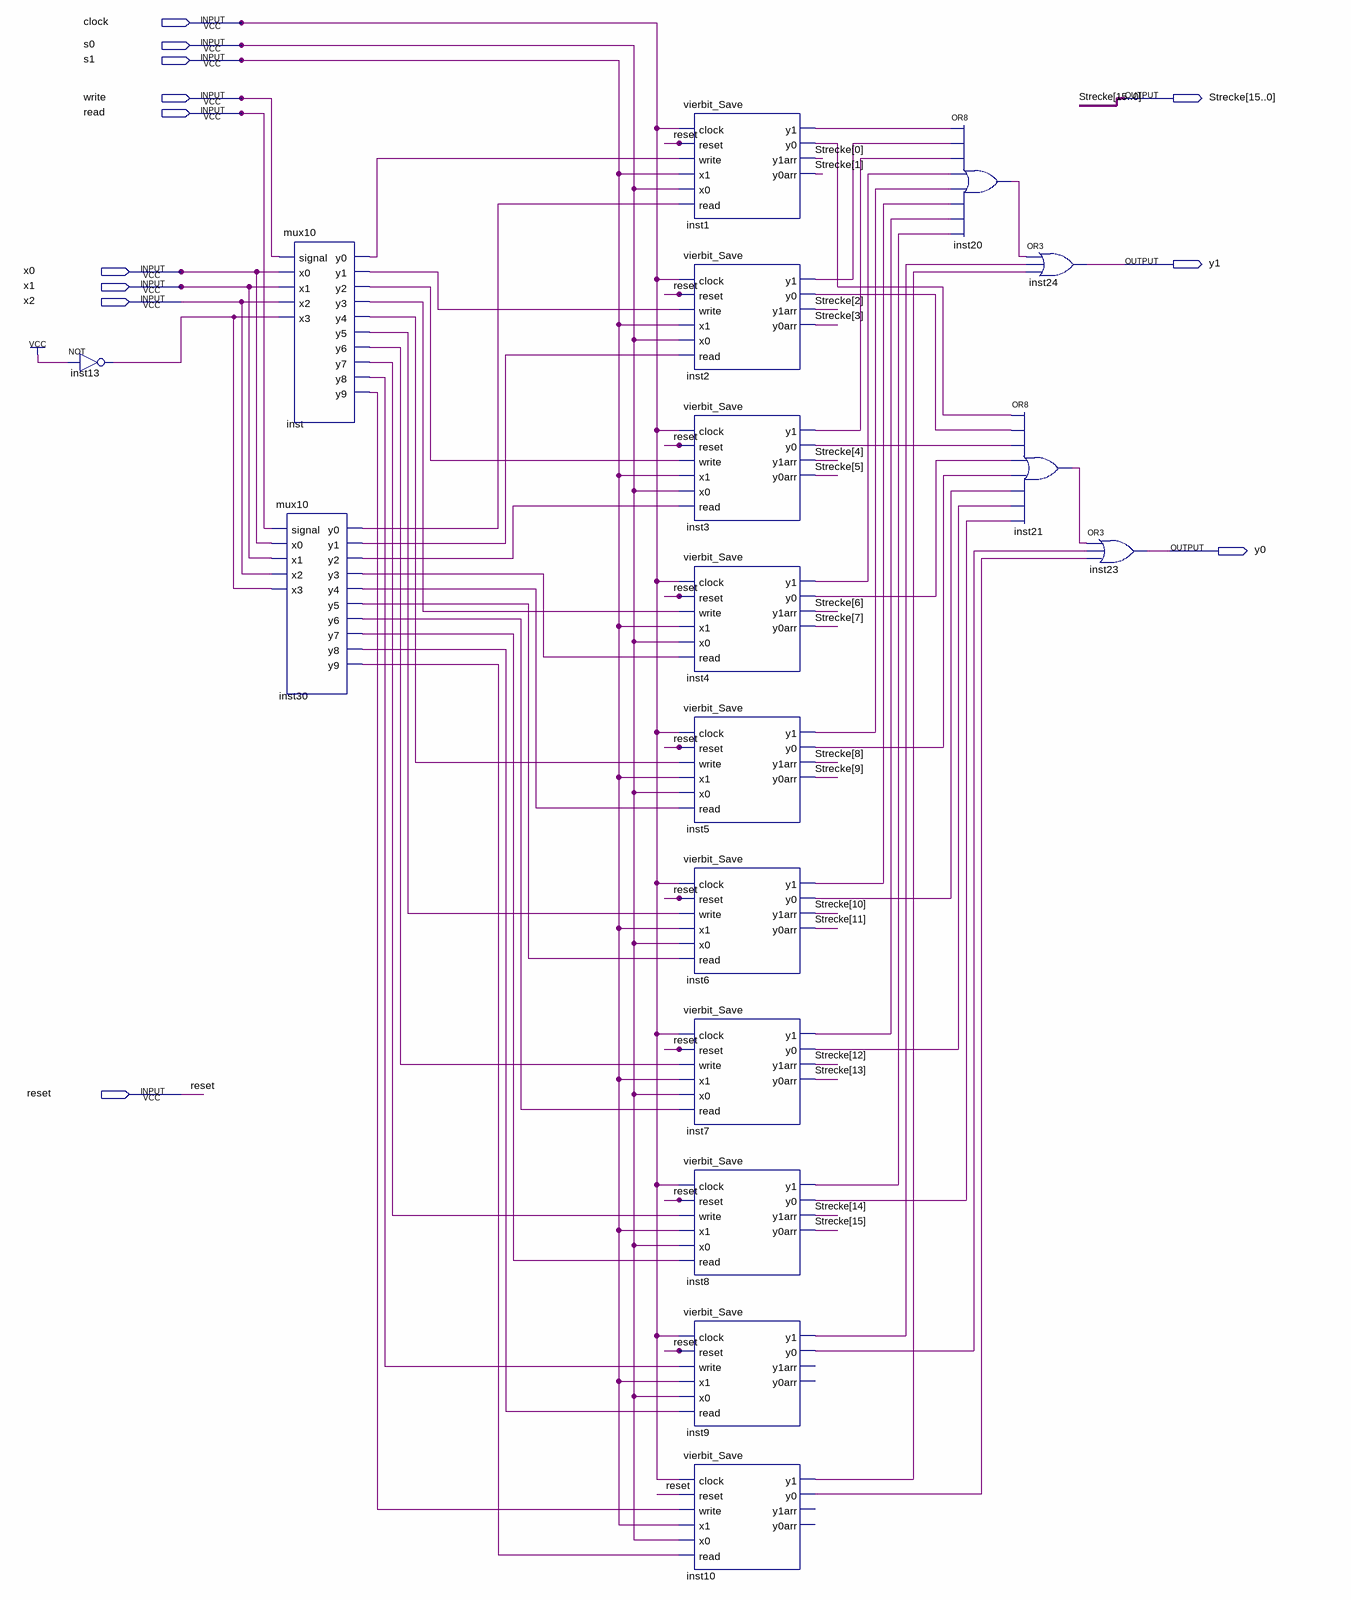
[diagram p0: schematic sheet]
// Quartus schematic routen_speicher.bdf as structural Verilog: 17 symbols, 12 pins
module routen_speicher (
  input  clock,
  input  s0,
  input  s1,
  input  write,
  input  read,
  input  x0,
  input  x1,
  input  x2,
  input  reset,
  output [15:0] Strecke,
  output y1,
  output y0
);

  wire inst1_y0, inst1_y1, inst2_y0, inst2_y1, inst3_y0, inst3_y1, inst4_y0, inst4_y1, inst5_y0, inst5_y1,
       inst6_y0, inst6_y1, inst7_y0, inst7_y1, inst8_y0, inst8_y1, inst9_y0, inst9_y1, inst10_y0, inst10_y1,
       inst13_out, inst20_out, inst21_out, inst30_y0, inst30_y1, inst30_y2, inst30_y3, inst30_y4, inst30_y5,
       inst30_y6, inst30_y7, inst30_y8, inst30_y9, inst_y0, inst_y1, inst_y2, inst_y3, inst_y4, inst_y5,
       inst_y6, inst_y7, inst_y8, inst_y9;

  not inst13 (inst13_out, 1'b1);
  mux10 inst (
    .signal(write), .x0(x0), .x1(x1), .x2(x2), .x3(inst13_out), .y0(inst_y0), .y1(inst_y1), .y2(inst_y2),
    .y3(inst_y3), .y4(inst_y4), .y5(inst_y5), .y6(inst_y6), .y7(inst_y7), .y8(inst_y8), .y9(inst_y9));
  mux10 inst30 (
    .signal(read), .x0(x0), .x1(x1), .x2(x2), .x3(inst13_out), .y0(inst30_y0), .y1(inst30_y1),
    .y2(inst30_y2), .y3(inst30_y3), .y4(inst30_y4), .y5(inst30_y5), .y6(inst30_y6), .y7(inst30_y7),
    .y8(inst30_y8), .y9(inst30_y9));
  vierbit_Save inst1 (
    .clock(clock), .reset(reset), .write(inst_y0), .x1(s1), .x0(s0), .read(inst30_y0), .y1(inst1_y1),
    .y0(inst1_y0), .y1arr(Strecke[0]), .y0arr(Strecke[1]));
  vierbit_Save inst2 (
    .clock(clock), .reset(reset), .write(inst_y1), .x1(s1), .x0(s0), .read(inst30_y1), .y1(inst2_y1),
    .y0(inst2_y0), .y1arr(Strecke[2]), .y0arr(Strecke[3]));
  vierbit_Save inst3 (
    .clock(clock), .reset(reset), .write(inst_y2), .x1(s1), .x0(s0), .read(inst30_y2), .y1(inst3_y1),
    .y0(inst3_y0), .y1arr(Strecke[4]), .y0arr(Strecke[5]));
  vierbit_Save inst4 (
    .clock(clock), .reset(reset), .write(inst_y3), .x1(s1), .x0(s0), .read(inst30_y3), .y1(inst4_y1),
    .y0(inst4_y0), .y1arr(Strecke[6]), .y0arr(Strecke[7]));
  vierbit_Save inst5 (
    .clock(clock), .reset(reset), .write(inst_y4), .x1(s1), .x0(s0), .read(inst30_y4), .y1(inst5_y1),
    .y0(inst5_y0), .y1arr(Strecke[8]), .y0arr(Strecke[9]));
  vierbit_Save inst6 (
    .clock(clock), .reset(reset), .write(inst_y5), .x1(s1), .x0(s0), .read(inst30_y5), .y1(inst6_y1),
    .y0(inst6_y0), .y1arr(Strecke[10]), .y0arr(Strecke[11]));
  vierbit_Save inst7 (
    .clock(clock), .reset(reset), .write(inst_y6), .x1(s1), .x0(s0), .read(inst30_y6), .y1(inst7_y1),
    .y0(inst7_y0), .y1arr(Strecke[12]), .y0arr(Strecke[13]));
  vierbit_Save inst8 (
    .clock(clock), .reset(reset), .write(inst_y7), .x1(s1), .x0(s0), .read(inst30_y7), .y1(inst8_y1),
    .y0(inst8_y0), .y1arr(Strecke[14]), .y0arr(Strecke[15]));
  vierbit_Save inst9 (
    .clock(clock), .reset(reset), .write(inst_y8), .x1(s1), .x0(s0), .read(inst30_y8), .y1(inst9_y1),
    .y0(inst9_y0));  // open: y1arr, y0arr
  vierbit_Save inst10 (
    .clock(clock), .reset(reset), .write(inst_y9), .x1(s1), .x0(s0), .read(inst30_y9), .y1(inst10_y1),
    .y0(inst10_y0));  // open: y1arr, y0arr
  or inst20 (inst20_out, inst1_y1, inst2_y1, inst3_y1, inst4_y1, inst5_y1, inst6_y1, inst7_y1, inst8_y1);
  or inst21 (inst21_out, inst1_y0, inst2_y0, inst3_y0, inst4_y0, inst5_y0, inst6_y0, inst7_y0, inst8_y0);
  or inst24 (y1, inst20_out, inst9_y1, inst10_y1);
  or inst23 (y0, inst21_out, inst9_y0, inst10_y0);
endmodule
